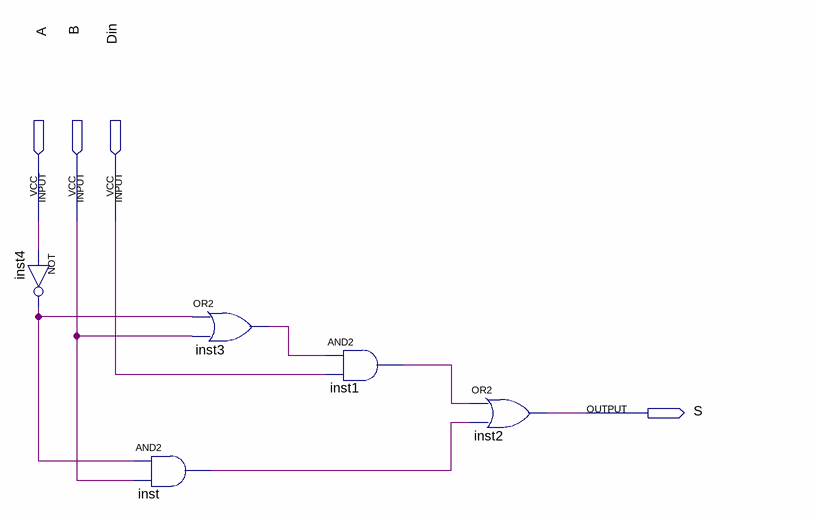
[diagram p0: schematic sheet]
// Quartus schematic MenorQue1Bit.bdf as structural Verilog: 5 symbols, 4 pins
module MenorQue1Bit (
  input  A,
  input  B,
  input  Din,
  output S
);

  wire inst1_out, inst3_out, inst4_out, inst_out;

  not inst4 (inst4_out, A);
  and inst (inst_out, inst4_out, B);
  or inst3 (inst3_out, inst4_out, B);
  and inst1 (inst1_out, inst3_out, Din);
  or inst2 (S, inst1_out, inst_out);
endmodule
